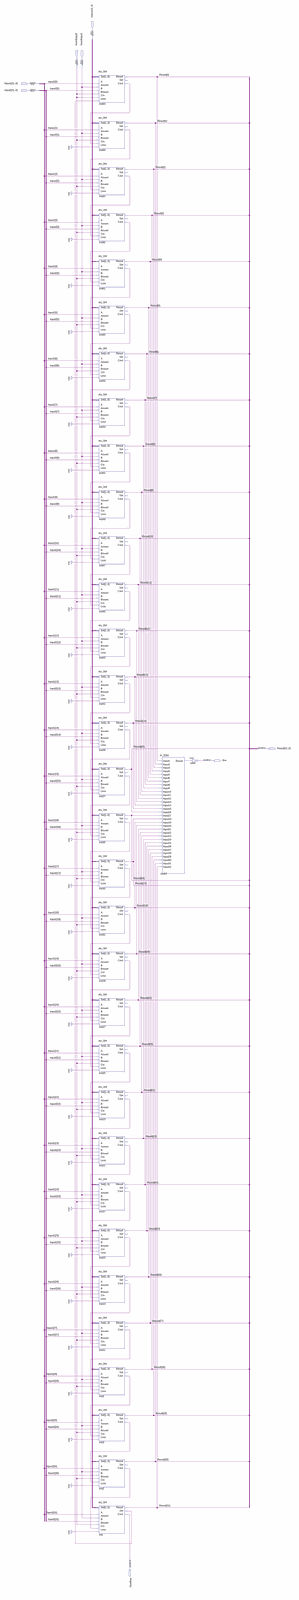
[diagram p0: schematic sheet, whole]
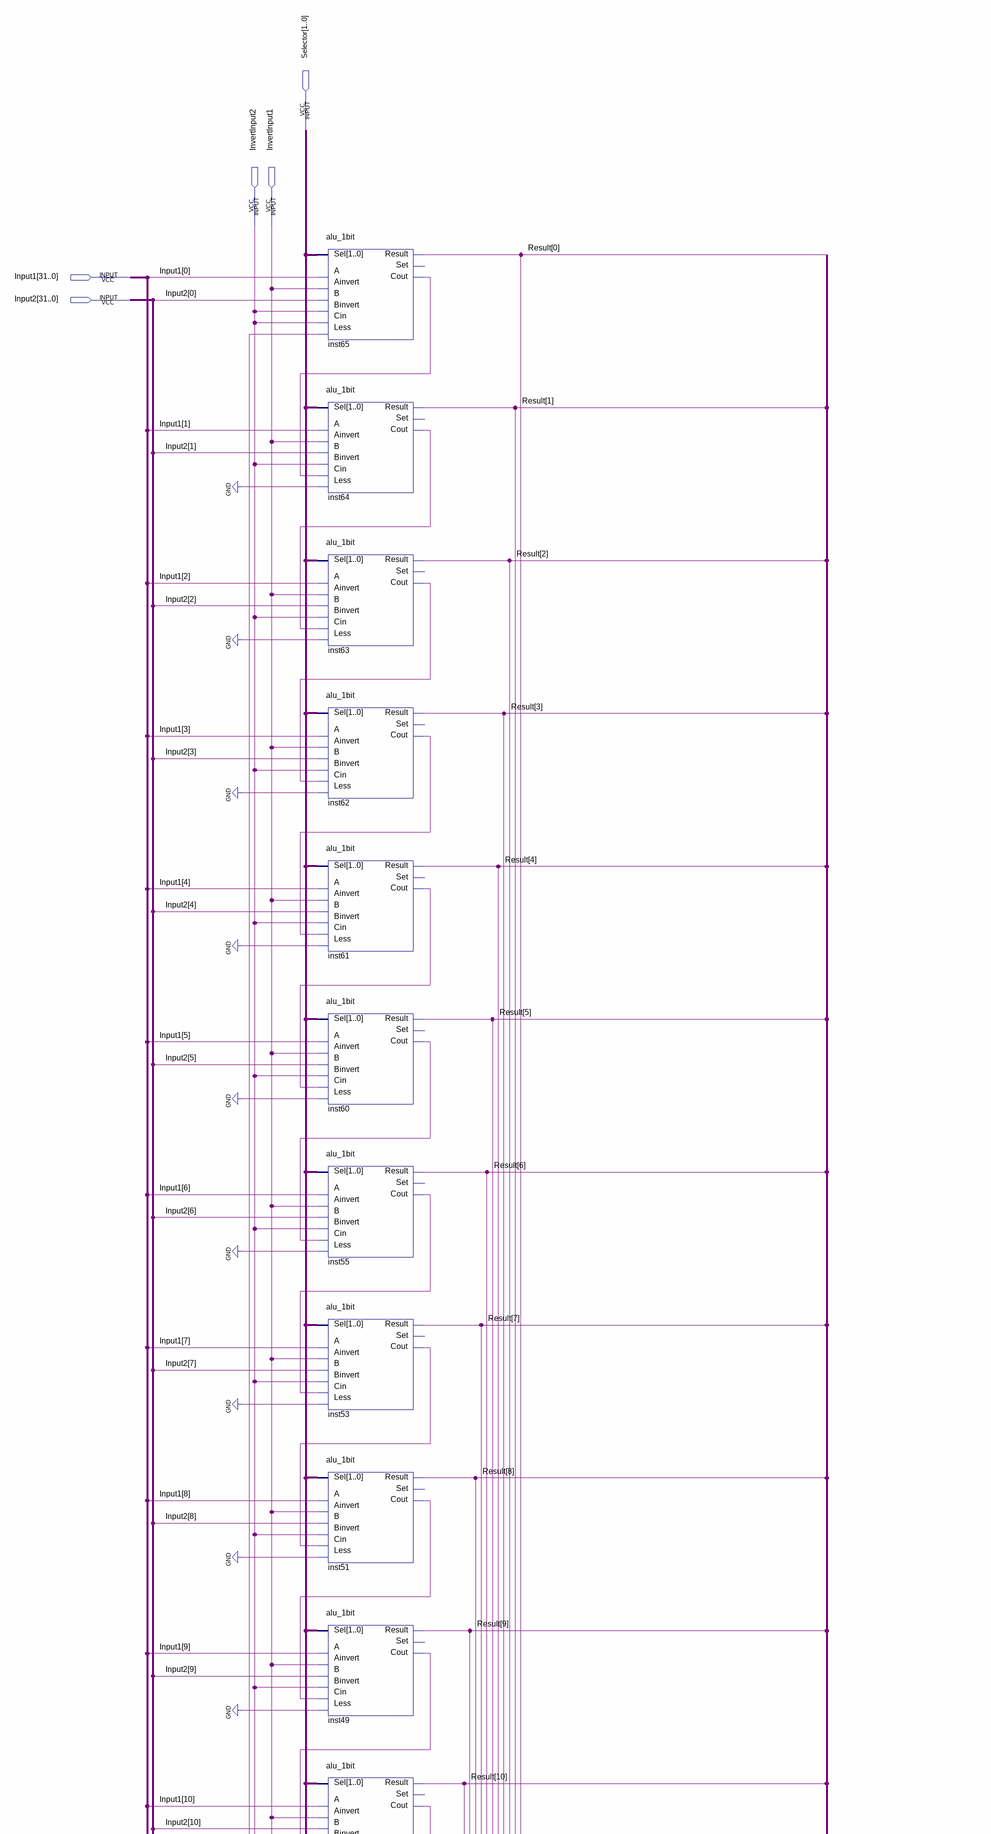
[diagram p1: schematic sheet, upper part]
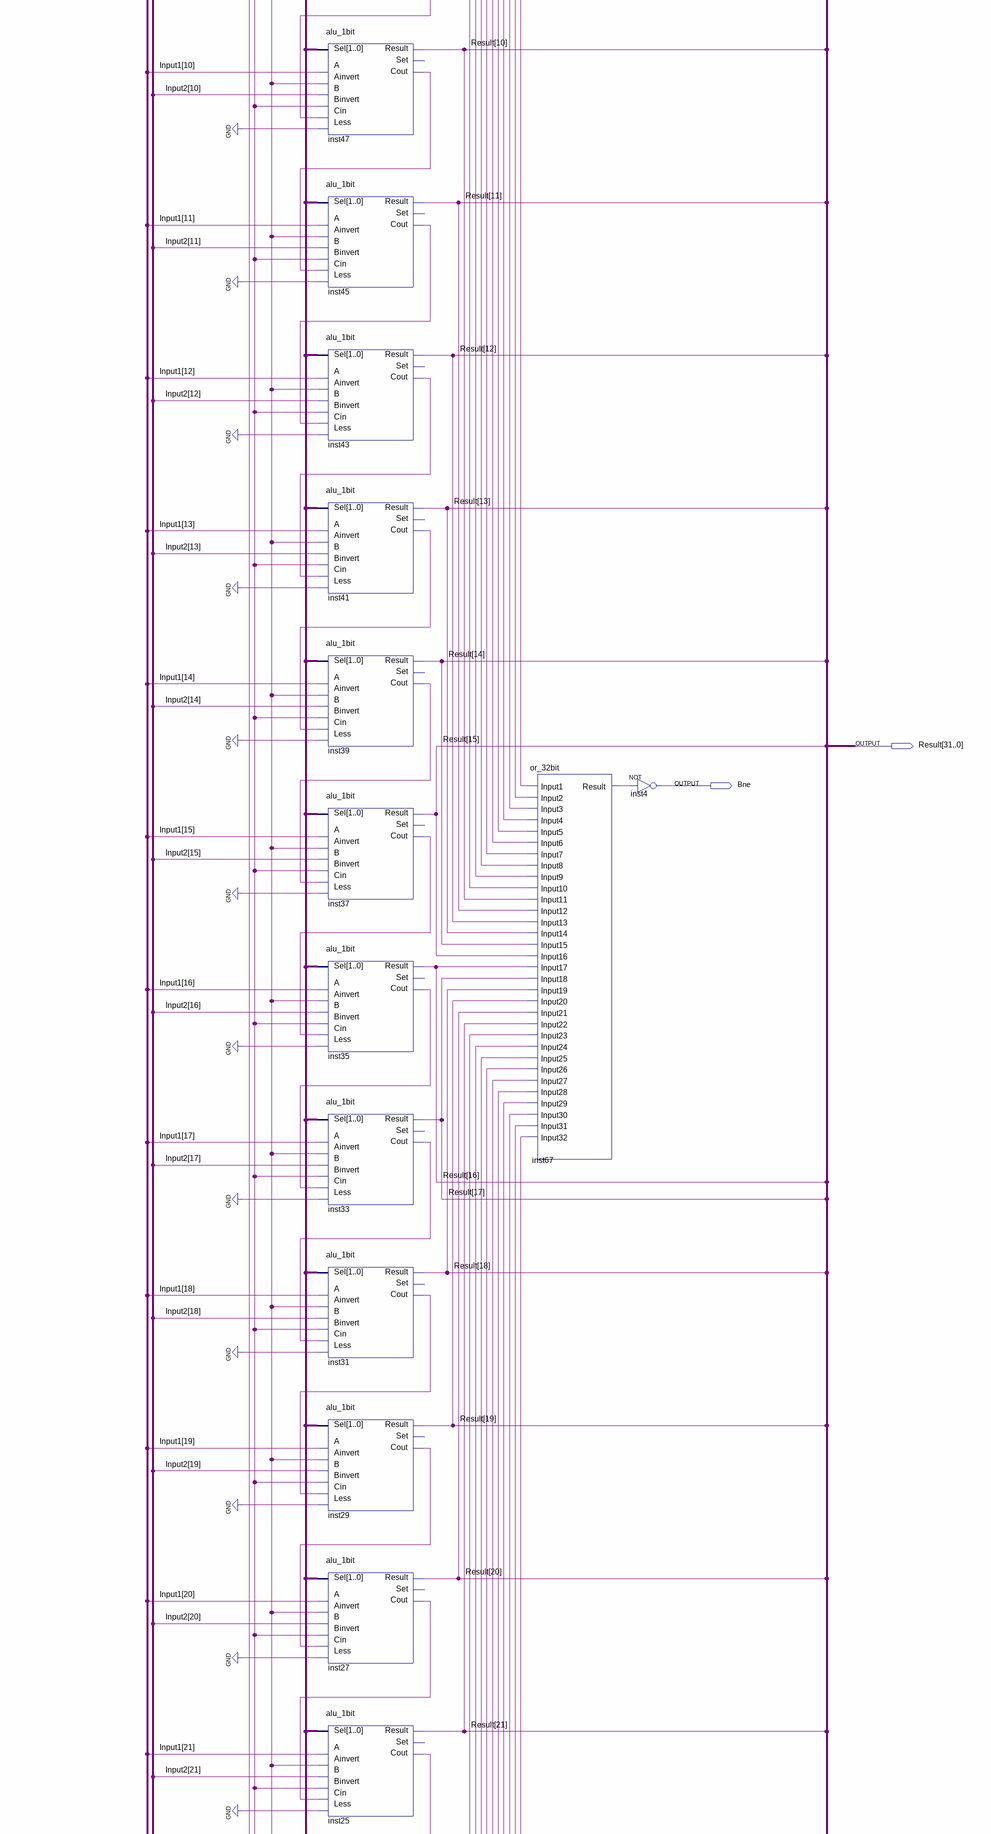
[diagram p2: schematic sheet, middle part]
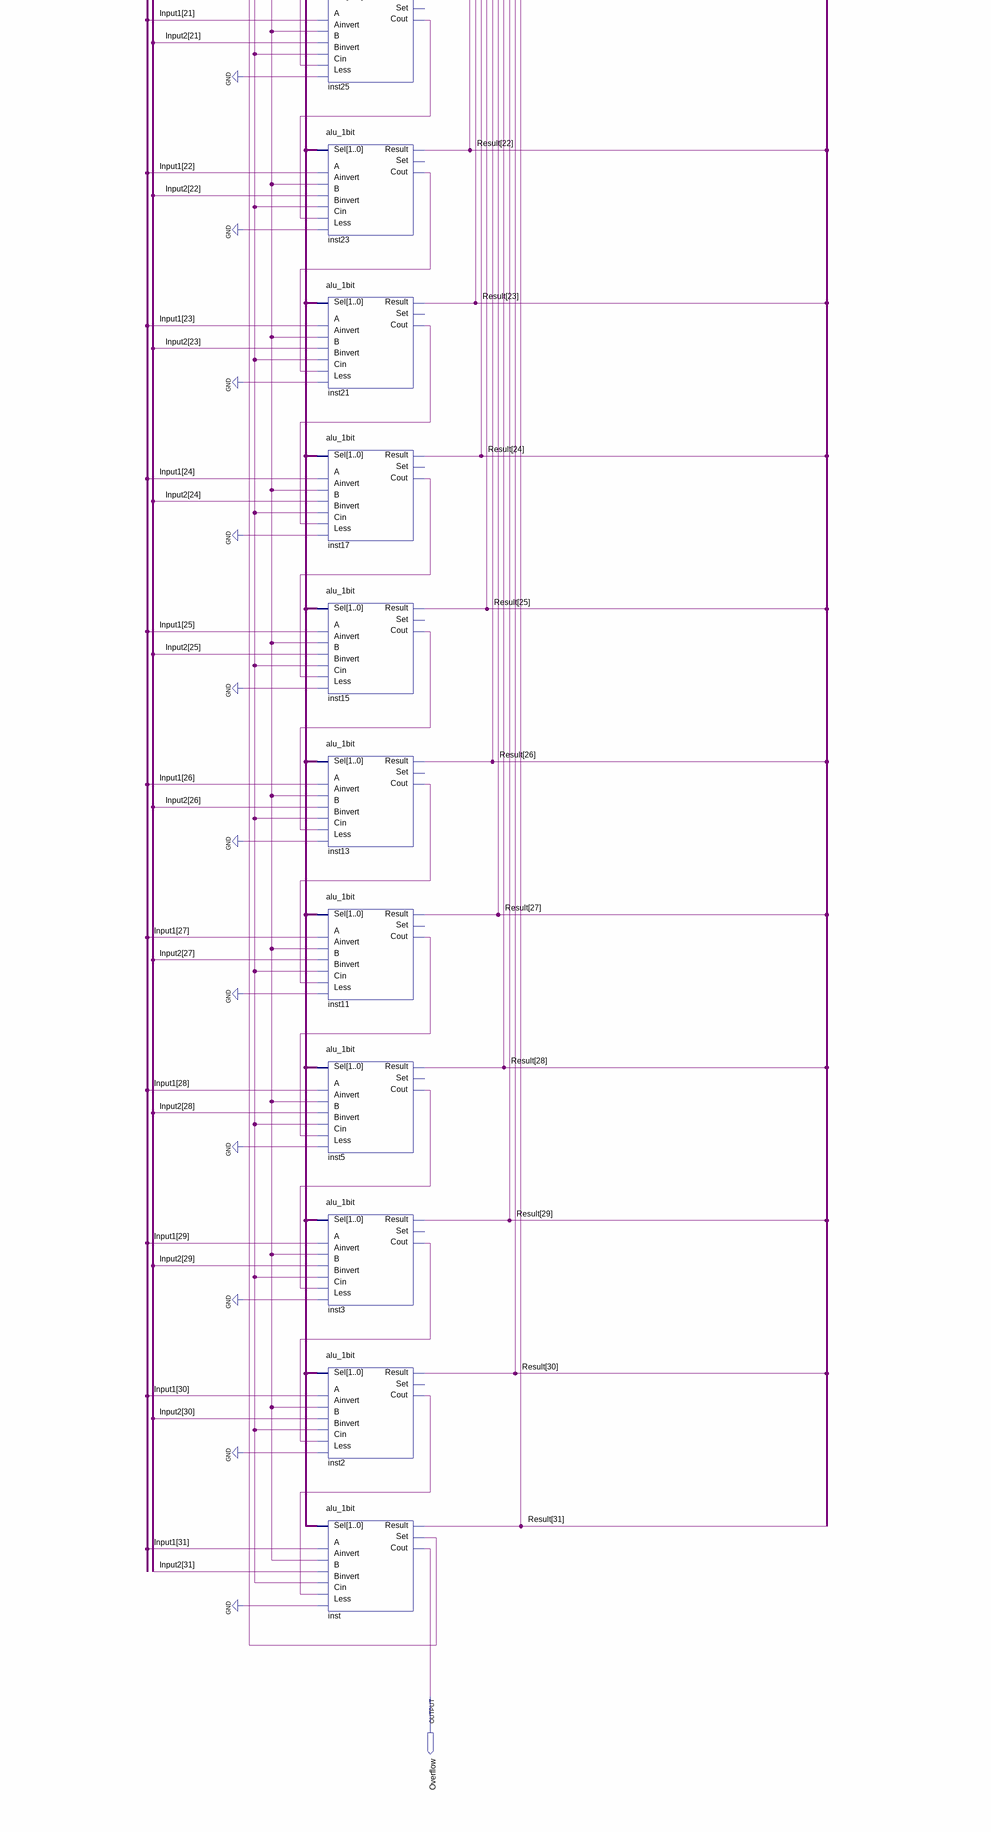
[diagram p3: schematic sheet, lower part]
// Quartus schematic alu_32bit.bdf as structural Verilog: 34 symbols, 8 pins
module alu_32bit (
  input  [1:0] Selector,
  input  InvertInput2,
  input  InvertInput1,
  input  [31:0] Input1,
  input  [31:0] Input2,
  output [31:0] Result,
  output Bne,
  output Overflow
);

  wire inst2_cout, inst3_cout, inst5_cout, inst11_cout, inst13_cout, inst15_cout, inst17_cout, inst21_cout,
       inst23_cout, inst25_cout, inst27_cout, inst29_cout, inst31_cout, inst33_cout, inst35_cout,
       inst37_cout, inst39_cout, inst41_cout, inst43_cout, inst45_cout, inst47_cout, inst49_cout,
       inst51_cout, inst53_cout, inst55_cout, inst60_cout, inst61_cout, inst62_cout, inst63_cout,
       inst64_cout, inst65_cout, inst67_result, inst_set;

  alu_1bit inst65 (
    .A(Input1[0]), .Ainvert(InvertInput1), .B(Input2[0]), .Sel(Selector), .Binvert(InvertInput2),
    .Less(inst_set), .Cin(InvertInput2), .Result(Result[0]), .Cout(inst65_cout));  // open: Set
  alu_1bit inst64 (
    .A(Input1[1]), .Ainvert(InvertInput1), .B(Input2[1]), .Sel(Selector), .Binvert(InvertInput2),
    .Less(1'b0), .Cin(inst65_cout), .Result(Result[1]), .Cout(inst64_cout));  // open: Set
  alu_1bit inst63 (
    .A(Input1[2]), .Ainvert(InvertInput1), .B(Input2[2]), .Sel(Selector), .Binvert(InvertInput2),
    .Less(1'b0), .Cin(inst64_cout), .Result(Result[2]), .Cout(inst63_cout));  // open: Set
  alu_1bit inst62 (
    .A(Input1[3]), .Ainvert(InvertInput1), .B(Input2[3]), .Sel(Selector), .Binvert(InvertInput2),
    .Less(1'b0), .Cin(inst63_cout), .Result(Result[3]), .Cout(inst62_cout));  // open: Set
  alu_1bit inst61 (
    .A(Input1[4]), .Ainvert(InvertInput1), .B(Input2[4]), .Sel(Selector), .Binvert(InvertInput2),
    .Less(1'b0), .Cin(inst62_cout), .Result(Result[4]), .Cout(inst61_cout));  // open: Set
  alu_1bit inst60 (
    .A(Input1[5]), .Ainvert(InvertInput1), .B(Input2[5]), .Sel(Selector), .Binvert(InvertInput2),
    .Less(1'b0), .Cin(inst61_cout), .Result(Result[5]), .Cout(inst60_cout));  // open: Set
  alu_1bit inst55 (
    .A(Input1[6]), .Ainvert(InvertInput1), .B(Input2[6]), .Sel(Selector), .Binvert(InvertInput2),
    .Less(1'b0), .Cin(inst60_cout), .Result(Result[6]), .Cout(inst55_cout));  // open: Set
  alu_1bit inst53 (
    .A(Input1[7]), .Ainvert(InvertInput1), .B(Input2[7]), .Sel(Selector), .Binvert(InvertInput2),
    .Less(1'b0), .Cin(inst55_cout), .Result(Result[7]), .Cout(inst53_cout));  // open: Set
  alu_1bit inst51 (
    .A(Input1[8]), .Ainvert(InvertInput1), .B(Input2[8]), .Sel(Selector), .Binvert(InvertInput2),
    .Less(1'b0), .Cin(inst53_cout), .Result(Result[8]), .Cout(inst51_cout));  // open: Set
  alu_1bit inst49 (
    .A(Input1[9]), .Ainvert(InvertInput1), .B(Input2[9]), .Sel(Selector), .Binvert(InvertInput2),
    .Less(1'b0), .Cin(inst51_cout), .Result(Result[9]), .Cout(inst49_cout));  // open: Set
  alu_1bit inst47 (
    .A(Input1[10]), .Ainvert(InvertInput1), .B(Input2[10]), .Sel(Selector), .Binvert(InvertInput2),
    .Less(1'b0), .Cin(inst49_cout), .Result(Result[10]), .Cout(inst47_cout));  // open: Set
  alu_1bit inst45 (
    .A(Input1[11]), .Ainvert(InvertInput1), .B(Input2[11]), .Sel(Selector), .Binvert(InvertInput2),
    .Less(1'b0), .Cin(inst47_cout), .Result(Result[11]), .Cout(inst45_cout));  // open: Set
  alu_1bit inst43 (
    .A(Input1[12]), .Ainvert(InvertInput1), .B(Input2[12]), .Sel(Selector), .Binvert(InvertInput2),
    .Less(1'b0), .Cin(inst45_cout), .Result(Result[12]), .Cout(inst43_cout));  // open: Set
  alu_1bit inst41 (
    .A(Input1[13]), .Ainvert(InvertInput1), .B(Input2[13]), .Sel(Selector), .Binvert(InvertInput2),
    .Less(1'b0), .Cin(inst43_cout), .Result(Result[13]), .Cout(inst41_cout));  // open: Set
  alu_1bit inst39 (
    .A(Input1[14]), .Ainvert(InvertInput1), .B(Input2[14]), .Sel(Selector), .Binvert(InvertInput2),
    .Less(1'b0), .Cin(inst41_cout), .Result(Result[14]), .Cout(inst39_cout));  // open: Set
  alu_1bit inst37 (
    .A(Input1[15]), .Ainvert(InvertInput1), .B(Input2[15]), .Sel(Selector), .Binvert(InvertInput2),
    .Less(1'b0), .Cin(inst39_cout), .Result(Result[15]), .Cout(inst37_cout));  // open: Set
  alu_1bit inst35 (
    .A(Input1[16]), .Ainvert(InvertInput1), .B(Input2[16]), .Sel(Selector), .Binvert(InvertInput2),
    .Less(1'b0), .Cin(inst37_cout), .Result(Result[16]), .Cout(inst35_cout));  // open: Set
  alu_1bit inst33 (
    .A(Input1[17]), .Ainvert(InvertInput1), .B(Input2[17]), .Sel(Selector), .Binvert(InvertInput2),
    .Less(1'b0), .Cin(inst35_cout), .Result(Result[17]), .Cout(inst33_cout));  // open: Set
  alu_1bit inst31 (
    .A(Input1[18]), .Ainvert(InvertInput1), .B(Input2[18]), .Sel(Selector), .Binvert(InvertInput2),
    .Less(1'b0), .Cin(inst33_cout), .Result(Result[18]), .Cout(inst31_cout));  // open: Set
  alu_1bit inst29 (
    .A(Input1[19]), .Ainvert(InvertInput1), .B(Input2[19]), .Sel(Selector), .Binvert(InvertInput2),
    .Less(1'b0), .Cin(inst31_cout), .Result(Result[19]), .Cout(inst29_cout));  // open: Set
  alu_1bit inst27 (
    .A(Input1[20]), .Ainvert(InvertInput1), .B(Input2[20]), .Sel(Selector), .Binvert(InvertInput2),
    .Less(1'b0), .Cin(inst29_cout), .Result(Result[20]), .Cout(inst27_cout));  // open: Set
  alu_1bit inst25 (
    .A(Input1[21]), .Ainvert(InvertInput1), .B(Input2[21]), .Sel(Selector), .Binvert(InvertInput2),
    .Less(1'b0), .Cin(inst27_cout), .Result(Result[21]), .Cout(inst25_cout));  // open: Set
  alu_1bit inst23 (
    .A(Input1[22]), .Ainvert(InvertInput1), .B(Input2[22]), .Sel(Selector), .Binvert(InvertInput2),
    .Less(1'b0), .Cin(inst25_cout), .Result(Result[22]), .Cout(inst23_cout));  // open: Set
  alu_1bit inst21 (
    .A(Input1[23]), .Ainvert(InvertInput1), .B(Input2[23]), .Sel(Selector), .Binvert(InvertInput2),
    .Less(1'b0), .Cin(inst23_cout), .Result(Result[23]), .Cout(inst21_cout));  // open: Set
  alu_1bit inst17 (
    .A(Input1[24]), .Ainvert(InvertInput1), .B(Input2[24]), .Sel(Selector), .Binvert(InvertInput2),
    .Less(1'b0), .Cin(inst21_cout), .Result(Result[24]), .Cout(inst17_cout));  // open: Set
  alu_1bit inst15 (
    .A(Input1[25]), .Ainvert(InvertInput1), .B(Input2[25]), .Sel(Selector), .Binvert(InvertInput2),
    .Less(1'b0), .Cin(inst17_cout), .Result(Result[25]), .Cout(inst15_cout));  // open: Set
  alu_1bit inst13 (
    .A(Input1[26]), .Ainvert(InvertInput1), .B(Input2[26]), .Sel(Selector), .Binvert(InvertInput2),
    .Less(1'b0), .Cin(inst15_cout), .Result(Result[26]), .Cout(inst13_cout));  // open: Set
  alu_1bit inst11 (
    .A(Input1[27]), .Ainvert(InvertInput1), .B(Input2[27]), .Sel(Selector), .Binvert(InvertInput2),
    .Less(1'b0), .Cin(inst13_cout), .Result(Result[27]), .Cout(inst11_cout));  // open: Set
  alu_1bit inst5 (
    .A(Input1[28]), .Ainvert(InvertInput1), .B(Input2[28]), .Sel(Selector), .Binvert(InvertInput2),
    .Less(1'b0), .Cin(inst11_cout), .Result(Result[28]), .Cout(inst5_cout));  // open: Set
  alu_1bit inst3 (
    .A(Input1[29]), .Ainvert(InvertInput1), .B(Input2[29]), .Sel(Selector), .Binvert(InvertInput2),
    .Less(1'b0), .Cin(inst5_cout), .Result(Result[29]), .Cout(inst3_cout));  // open: Set
  alu_1bit inst2 (
    .A(Input1[30]), .Ainvert(InvertInput1), .B(Input2[30]), .Sel(Selector), .Binvert(InvertInput2),
    .Less(1'b0), .Cin(inst3_cout), .Result(Result[30]), .Cout(inst2_cout));  // open: Set
  alu_1bit inst (
    .A(Input1[31]), .Ainvert(InvertInput1), .B(Input2[31]), .Sel(Selector), .Binvert(InvertInput2),
    .Less(1'b0), .Cin(inst2_cout), .Result(Result[31]), .Cout(Overflow), .Set(inst_set));
  or_32bit inst67 (
    .Input1(Result[0]), .Input2(Result[1]), .Input3(Result[2]), .Input4(Result[3]), .Input5(Result[4]),
    .Input6(Result[5]), .Input7(Result[6]), .Input8(Result[7]), .Input9(Result[8]), .Input10(Result[9]),
    .Input11(Result[10]), .Input12(Result[11]), .Input13(Result[12]), .Input14(Result[13]),
    .Input15(Result[14]), .Input16(Result[15]), .Input17(Result[16]), .Input18(Result[17]),
    .Input19(Result[18]), .Input20(Result[19]), .Input21(Result[20]), .Input22(Result[21]),
    .Input23(Result[22]), .Input24(Result[23]), .Input25(Result[24]), .Input26(Result[25]),
    .Input27(Result[26]), .Input28(Result[27]), .Input29(Result[28]), .Input30(Result[29]),
    .Input31(Result[30]), .Input32(Result[31]), .Result(inst67_result));
  not inst4 (Bne, inst67_result);
endmodule
